# EasyEDA Pro project 无刷双驱_2025-10-18.epro, board PCB1_1
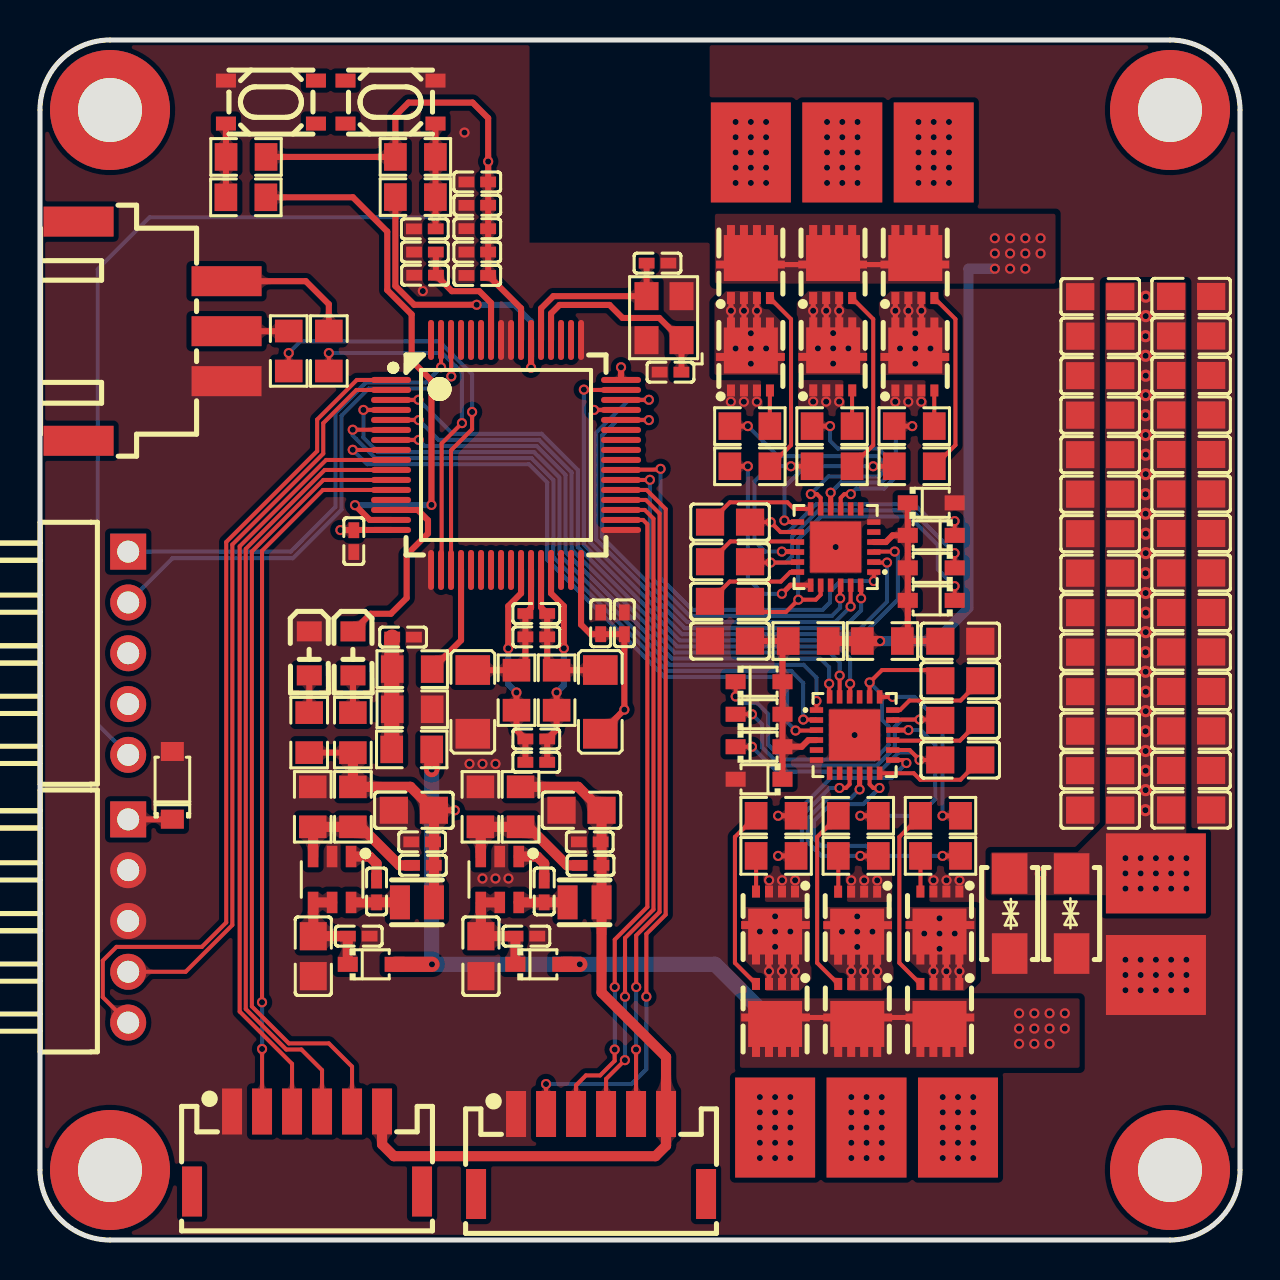
[diagram p2: board, top side]
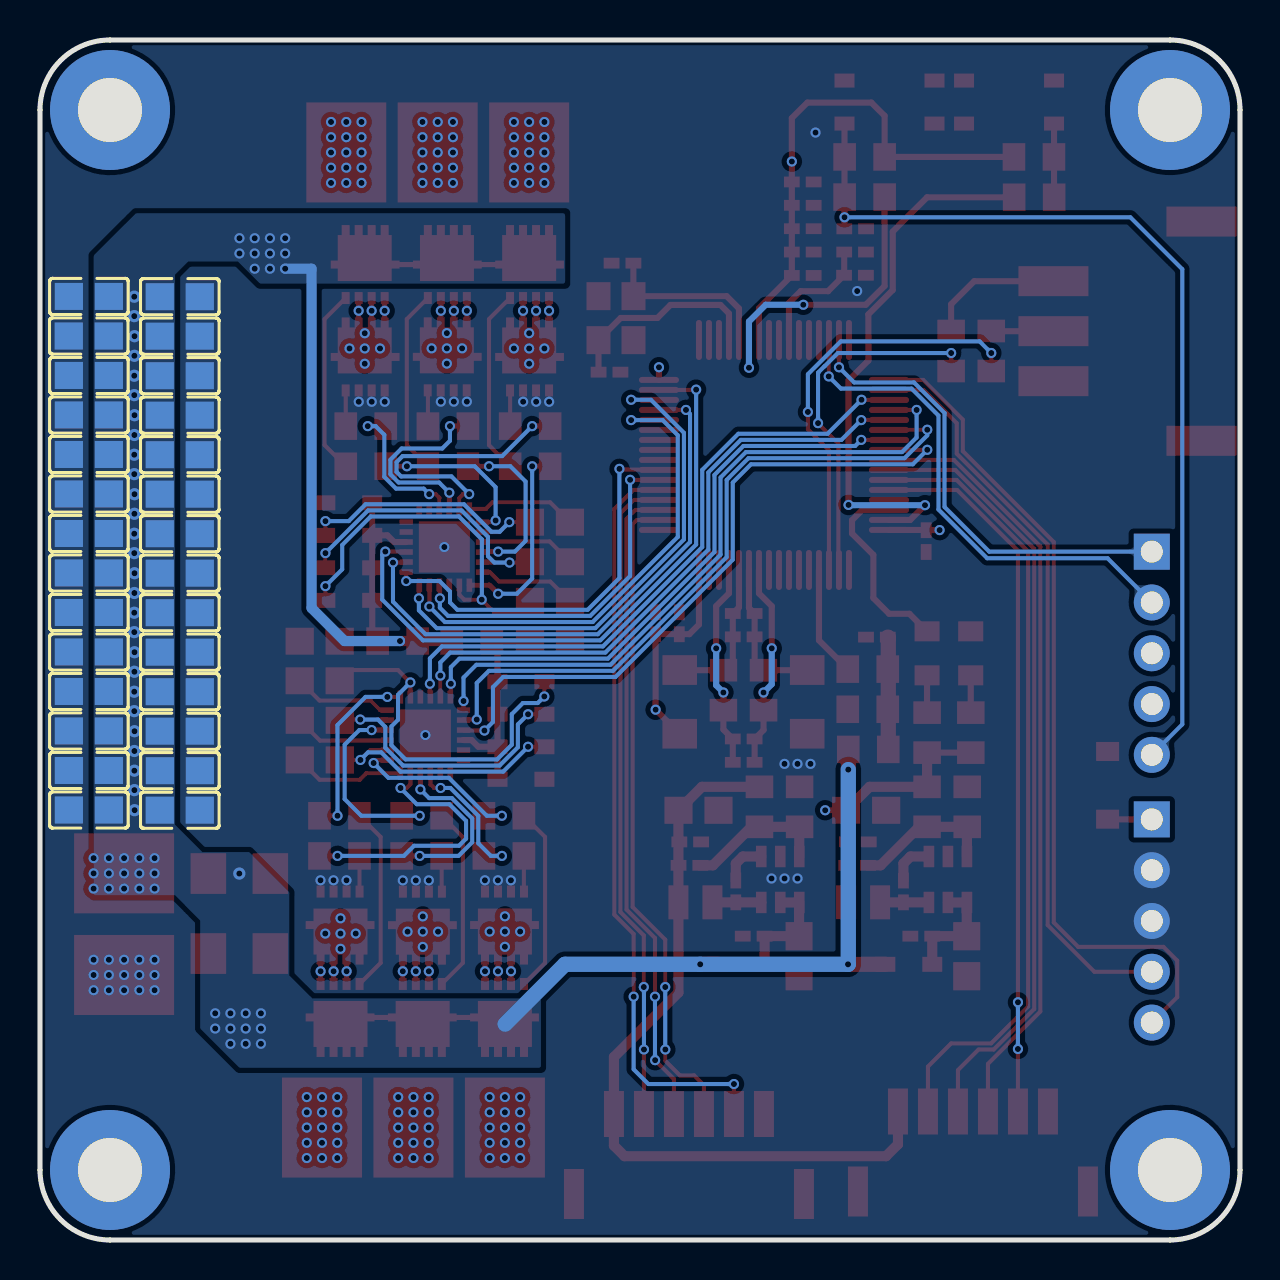
[diagram p3: board, bottom side, seen from below]

Outline 60 x 60 mm; copper layers: Top Layer, Inner1, 内层2, Bottom Layer. Coordinates in mm from the lower left corner of the outline.
Outline path: 0,56.5 0,3.5 arc(1.03,1.03) 3.5,0 56.5,0 arc(58.97,1.03) 60,3.5 60,56.5 arc(58.97,58.97) 56.5,60 3.5,60 arc(1.03,58.97) 0,56.5
Stack: Top Layer 0.035mm 外层铜厚1oz / Dielectric1 0.2104mm 7628 RC49% 8.6mil / Inner1 0.0152mm 内层铜厚 / Dielectric2 1.065mm 1.1mm H/HOZ Copper / 内层2 0.0152mm 内层铜厚 / Dielectric3 0.2104mm 7628 RC49% 8.6mil / Bottom Layer 0.035mm 外层铜厚1oz

## Design rules (mm)
template: 自定义配置
spacing copperThickness1oz (default): track to track 0.102, other pairs 0.152 to 0.3
spacing copperThickness2oz: track to track 0.203, other pairs 0.152 to 0.3
track width copperThickness1oz (default): min 0.127, default 0.254, max 2.54
track width copperThickness2oz: min 0.203, default 0.254, max 2.54
differential pair differentialPair (default): width min 0.127, default 0.254, max 2.54; gap min 0.152, default 0.152
via viaSize (default): diameter min 0.5, default 0.61, max 10; hole min 0.3, default 0.305, max 6.3
net GND uses innerPlane1

## Placement (name value [footprint] x y rotation side)
C1  4.7uF  [C0402]  19.25 48.24 180 top
C2  100nF  [C0402]  19.25 49.4 180 top
C3  4.7uF  [C0402]  24.81 30.16 0 top
C4  100nF  [C0402]  24.81 31.33 0 top
C5  2.2uF  [C0402]  24.81 25.05 0 top
C6  100nF  [C0402]  24.81 23.88 0 top
C7  100nF  [C0402]  19.24 50.56 0 top
C8  4.7uF  [C0402]  15.69 34.94 90 top
C9  4.7uF  [C0402]  29.22 30.84 270 top
C10  100nF  [C0402]  21.86 48.23 180 top
C11  100nF  [C0402]  28.03 30.83 270 top
C12  4.7uF  [C0402]  21.86 50.57 180 top
C13  100nF  [C0402]  21.86 49.4 180 top
C14  4.7uF  [C0402]  21.86 52.9 180 top
C15  10pF  [C0402]  31.53 43.39 180 top
C16  10pF  [C0402]  30.88 48.84 180 top
C17  100nF  [C0402]  21.86 51.73 180 top
C18  4.7uF  [C0805]  34.5 31.93 180 top
C19  22uF  [C0805]  57.56 45.2 0 top
C20  22uF  [C0805]  53.01 31.37 180 top
C21  100nF  [C0402]  25.21 17.43 90 top
C22  220pF  [C0402]  27.53 18.73 0 top
C23  22uF  [C0805]  27.08 21.49 0 top
C24  100nF  [C0402]  27.49 19.91 0 top
C25  4.7uF  [C0805]  46.01 27.96 0 top
C26  22uF  [C0805]  22.05 14.19 90 top
C27  100nF  [C0402]  24.32 15.19 180 top
C28  4.7uF  [C0805]  34.5 33.91 180 top
C29  4.7uF  [C0805]  46.01 25.98 0 top
C30  4.7uF  [C0805]  34.5 35.89 0 top
C31  100nF  [C0402]  16.83 17.43 90 top
C32  220pF  [C0402]  19.15 18.73 0 top
C33  22uF  [C0805]  18.69 21.49 0 top
C34  100nF  [C0402]  19.11 19.91 0 top
C35  4.7uF  [C0805]  46.01 24 180 top
C36  22uF  [C0805]  46.01 29.94 0 top
C37  22uF  [C0805]  13.66 14.19 90 top
C38  100nF  [C0402]  15.94 15.19 180 top
C39  22uF  [C0805]  34.5 29.95 180 top
C40  22uF  [C0805]  57.56 33.35 0 top
C41  22uF  [C0805]  57.56 35.33 0 top
C42  22uF  [C0805]  57.56 41.25 0 top
C43  22uF  [C0805]  57.55 23.48 0 top
C44  22uF  [C0805]  53.01 23.47 180 top
C45  22uF  [C0805]  53.01 25.44 180 top
C46  22uF  [C0805]  53.01 27.42 180 top
C47  22uF  [C0805]  57.56 27.43 0 top
C48  22uF  [C0805]  57.56 21.5 0 top
C49  100nF  [C0402]  18.15 30.14 180 top
C50  22uF  [C0805]  53.01 21.49 180 top
C51  22uF  [C0805]  57.56 43.23 0 top
C52  22uF  [C0805]  53.01 33.34 180 top
C53  22uF  [C0805]  57.56 39.28 0 top
C54  22uF  [C0805]  53.01 29.39 180 top
C55  22uF  [C0805]  57.56 47.18 0 top
C56  22uF  [C0805]  57.56 37.3 0 top
C57  22uF  [C0805]  57.56 31.38 0 top
C58  22uF  [C0805]  57.56 29.4 0 top
C59  22uF  [C0805]  57.56 25.45 0 top
C60  22uF  [C0805]  53.01 35.32 180 top
C61  22uF  [C0805]  53.01 37.29 180 top
C62  22uF  [C0805]  53.01 39.27 180 top
C63  22uF  [C0805]  53.01 41.24 180 top
C64  22uF  [C0805]  53.01 45.19 180 top
C65  22uF  [C0805]  53.01 47.17 180 top
C66  22uF  [C0805]  53.01 43.22 180 top
C67  22uF  [C0805]  57.56 23.48 180 bottom
C68  22uF  [C0805]  53.01 29.39 0 bottom
C69  22uF  [C0805]  57.56 25.45 180 bottom
C70  22uF  [C0805]  57.56 33.35 180 bottom
C71  22uF  [C0805]  57.56 29.4 180 bottom
C72  22uF  [C0805]  57.56 27.43 180 bottom
C73  22uF  [C0805]  53.01 39.27 0 bottom
C74  22uF  [C0805]  53.01 37.29 0 bottom
C75  22uF  [C0805]  57.56 31.38 180 bottom
C76  22uF  [C0805]  53.01 31.37 0 bottom
C77  22uF  [C0805]  57.56 43.23 180 bottom
C78  22uF  [C0805]  53.01 33.34 0 bottom
C79  22uF  [C0805]  53.01 35.32 0 bottom
C80  22uF  [C0805]  57.56 41.25 180 bottom
C81  22uF  [C0805]  57.56 45.2 180 bottom
C82  22uF  [C0805]  57.56 47.18 180 bottom
C83  22uF  [C0805]  57.56 35.33 180 bottom
C84  22uF  [C0805]  57.56 21.5 180 bottom
C85  22uF  [C0805]  57.56 37.3 180 bottom
C86  22uF  [C0805]  53.01 41.24 0 bottom
C87  22uF  [C0805]  57.56 39.28 180 bottom
C88  22uF  [C0805]  53.01 25.44 0 bottom
C89  22uF  [C0805]  53.01 27.42 0 bottom
C90  22uF  [C0805]  53.01 43.22 0 bottom
C91  22uF  [C0805]  53 23.47 0 bottom
C92  22uF  [C0805]  53.01 21.49 0 bottom
C93  22uF  [C0805]  53.01 45.19 0 bottom
C94  22uF  [C0805]  53.01 47.17 0 bottom
D1  B5819WS  [SOD-323_L1.8-W1.3-LS2.5-RD]  24.94 13.78 0 top
D3  SMAJ16CA  [SMA_L4.4-W2.6-LS5.0-BI]  51.58 16.32 270 top
D4  B5819WS  [SOD-323_L1.8-W1.3-LS2.5-RD]  44.56 31.98 180 top
D5  B5819WS  [SOD-323_L1.8-W1.3-LS2.5-RD]  35.95 27.91 0 top
D6  B5819WS  [SOD-323_L1.8-W1.3-LS2.5-RD]  44.56 33.61 180 top
D7  B5819WS  [SOD-323_L1.8-W1.3-LS2.5-RD]  35.95 26.29 0 top
D8  B5819WS  [SOD-323_L1.8-W1.3-LS2.5-RD]  44.56 35.23 180 top
D9  B5819WS  [SOD-323_L1.8-W1.3-LS2.5-RD]  35.95 24.66 0 top
D10  B5819WS  [SOD-323_L1.8-W1.3-LS2.5-RD]  44.56 36.86 0 top
D11  B5819WS  [SOD-323_L1.8-W1.3-LS2.5-RD]  35.95 23.04 180 top
D12  SMF3.3A  [SOD-123_L2.8-W1.8-LS3.7-RD]  6.62 22.73 90 top
D13  B5819WS  [SOD-323_L1.8-W1.3-LS2.5-RD]  16.56 13.78 0 top
D14  SMAJ16CA  [SMA_L4.4-W2.6-LS5.0-BI]  48.48 16.32 90 top
FB1  120R  [L1206]  28.01 26.91 90 top
FB2  120R  [L1206]  21.64 26.91 90 top
H2  PZ254R-11-05P  [HDR-TH_5P-P2.54-H-M-W10.4]  4.41 29.34 270 top
H3  PZ254R-11-05P  [HDR-TH_5P-P2.54-H-M-W10.4]  4.41 15.95 270 top
L1  4.7uH  [IND-SMD_L2.0-W1.6-B]  27.23 16.88 0 top
L2  4.7uH  [IND-SMD_L2.0-W1.6-B]  18.85 16.88 0 top
LED1  -  [LED_0805]  13.46 29.28 270 top
LED2  -  [LED_0805]  15.64 29.28 270 top
NC1  RH-5000  [TEST-TH_BD2.54-P1.4_RED]  55.8 18.33 0 top
NC2  RH-5000  [TEST-TH_BD2.54-P1.4_RED]  55.8 13.25 0 top
NC3  RH-5000  [TEST-TH_BD2.54-P1.4_RED]  35.54 54.38 90 top
NC4  RH-5000  [TEST-TH_BD2.54-P1.4_RED]  40.11 54.38 90 top
NC5  RH-5000  [TEST-TH_BD2.54-P1.4_RED]  44.69 54.38 90 top
NC6  RH-5000  [TEST-TH_BD2.54-P1.4_RED]  45.9 5.62 90 top
NC7  RH-5000  [TEST-TH_BD2.54-P1.4_RED]  41.33 5.62 270 top
NC8  RH-5000  [TEST-TH_BD2.54-P1.4_RED]  36.76 5.62 270 top
NOREF  -  [Pad_e262]  56.5 56.5 0 top
NOREF#2  -  [Pad_e260]  3.5 3.5 0 top
NOREF#3  -  [Pad_e258]  3.5 56.5 0 top
NOREF#4  -  [Pad_e261]  56.5 3.5 0 top
P1  BX-XH2.54-3PWT  [CONN-SMD_3P-P2.50_BX-XH2.54-3PWT]  5.63 45.44 270 top
P3  ZX-ZH1.5-6PWT  [CONN-SMD_6P-P1.50_ZX-ZH1.5-6PWT]  13.35 4.43 0 top
P4  ZX-ZH1.5-6PWT  [CONN-SMD_6P-P1.50_ZX-ZH1.5-6PWT]  27.55 4.3 0 top
Q1  TPN2R703NL,L1Q(M  [TSON-8_L3.1-W3.1-P0.65-LS3.3-BL-EP]  35.52 48.77 0 top
Q2  TPN2R703NL,L1Q(M  [TSON-8_L3.1-W3.1-P0.65-LS3.3-BL-EP]  39.63 48.77 0 top
Q3  TPN2R703NL,L1Q(M  [TSON-8_L3.1-W3.1-P0.65-LS3.3-BL-EP]  43.74 48.77 0 top
Q4  TPN2R703NL,L1Q(M  [TSON-8_L3.1-W3.1-P0.65-LS3.3-BL-EP]  45 11.13 180 top
Q5  TPN2R703NL,L1Q(M  [TSON-8_L3.1-W3.1-P0.65-LS3.3-BL-EP]  40.88 11.13 180 top
Q6  TPN2R703NL,L1Q(M  [TSON-8_L3.1-W3.1-P0.65-LS3.3-BL-EP]  36.78 11.13 180 top
Q7  TPN2R703NL,L1Q(M  [TSON-8_L3.1-W3.1-P0.65-LS3.3-BL-EP]  35.52 44.15 0 top
Q8  TPN2R703NL,L1Q(M  [TSON-8_L3.1-W3.1-P0.65-LS3.3-BL-EP]  39.64 44.16 0 top
Q9  TPN2R703NL,L1Q(M  [TSON-8_L3.1-W3.1-P0.65-LS3.3-BL-EP]  43.74 44.15 0 top
Q10  TPN2R703NL,L1Q(M  [TSON-8_L3.1-W3.1-P0.65-LS3.3-BL-EP]  45 15.75 180 top
Q11  TPN2R703NL,L1Q(M  [TSON-8_L3.1-W3.1-P0.65-LS3.3-BL-EP]  40.88 15.74 180 top
Q12  TPN2R703NL,L1Q(M  [TSON-8_L3.1-W3.1-P0.65-LS3.3-BL-EP]  36.78 15.75 180 top
R1  10K  [R0805]  18.77 54.15 0 top
R2  0Ω  [R0805]  25.83 27.49 270 top
R3  100R  [R0805]  42.12 29.95 0 top
R4  100R  [R0805]  18.77 52.15 0 top
R5  100R  [R0805]  38.41 29.95 180 top
R6  4.7R  [R0805]  35.49 38.69 0 top
R7  4.7R  [R0805]  39.6 38.69 0 top
R8  0Ω  [R0805]  23.82 27.49 270 top
R9  100R  [R0805]  10.29 52.14 180 top
R10  4.7K  [R0805]  10.3 54.15 180 top
R11  4.7R  [R0805]  43.71 38.69 0 top
R12  1K  [R0805]  13.46 25.37 90 top
R13  4.7R  [R0805]  45.03 21.21 180 top
R14  4.7R  [R0805]  40.91 21.21 180 top
R15  4.7R  [R0805]  36.81 21.21 180 top
R16  4.7R  [R0805]  35.49 40.69 0 top
R17  1K  [R0805]  15.64 25.37 90 top
R18  4.7R  [R0805]  39.6 40.69 0 top
R19  4.7R  [R0805]  43.71 40.69 0 top
R20  100R  [R0805]  14.44 44.45 270 top
R21  4.7R  [R0805]  45.03 19.2 180 top
R22  73.2K  [R0805]  24.03 21.66 90 top
R23  10K  [R0805]  22.02 21.66 270 top
R24  4.7R  [R0805]  40.91 19.2 180 top
R25  4.7R  [R0805]  36.81 19.2 180 top
R26  100R  [R0805]  12.44 44.45 270 top
R38  45.3K  [R0805]  15.65 21.66 90 top
R45  10K  [R0805]  13.64 21.66 270 top
R68  1K  [R0805]  18.61 26.54 180 top
R69  10K  [R0805]  18.59 24.53 0 top
R70  100R  [R0805]  18.61 28.54 0 top
S1  TS1145A26025  [SW-SMD_4P-L4.2-W3.2-P2.15-LS4.6]  17.53 56.9 180 top
S2  TS1145A26025  [SW-SMD_4P-L4.2-W3.2-P2.15-LS4.6]  11.55 56.9 0 top
U1  CYT2BL3CAAQ0AZEGS  [LQFP-64_L10.0-W10.0-P0.50-LS12.0-BL]  23.3 39.25 270 top
U2  FD6288Q  [QFN-24_L4.0-W4.0-P0.50-BL-EP2.6]  39.78 34.65 90 top
U4  RY9121E  [SOT-23-6_L2.9-W1.6-P0.95-LS2.8-BL]  22.99 18.03 180 top
U5  FD6288Q  [QFN-24_L4.0-W4.0-P0.50-BL-EP2.6]  40.73 25.25 270 top
U7  RY9121E  [SOT-23-6_L2.9-W1.6-P0.95-LS2.8-BL]  14.6 18.03 180 top
Y1  16MHz  [OSC-SMD_4P-L3.2-W2.5-BL]  31.2 46.09 90 top

## Footprints (pads in the part's own frame, mm; a bottom-side part is the same pattern mirrored in y, then rotated)
C0402
  rect 0.79x0.54 smd: 1(-0.545,0) 2(0.545,0)
C0805
  rect 1.41x1.35 smd: 1(-1,0) 2(1,0)
CONN-SMD_3P-P2.50_BX-XH2.54-3PWT
  rect 1.5x3.5 smd: 1(-2.5,3.7) 2(0,3.7) 3(2.5,3.7) 4(5.48,-3.7) 5(-5.48,-3.7)
CONN-SMD_6P-P1.50_ZX-ZH1.5-6PWT
  rect 1x2.3 smd: 1(-3.75,2) 2(-2.25,2) 3(-0.75,2) 4(0.75,2) 5(2.25,2) 6(3.75,2)
  rect 1x2.5 smd: 7(5.75,-2) 8(-5.75,-2)
HDR-TH_5P-P2.54-H-M-W10.4
  rect 1.8x1.8 hole 1.1: 1(-5.08,0)
  round 1.8 hole 1.1: 2(-2.54,0) 3(0,0) 4(2.54,0) 5(5.08,0)
IND-SMD_L2.0-W1.6-B
  rect 1x1.7 smd: 1(-0.85,0) 2(0.85,0)
L1206
  rect 1.485x1.728 smd: 1(-1.593,0) 2(1.593,0)
LED_0805
  rect 1x1.25 smd: 1(-1.15,0.005) 2(1.05,0.005)
LQFP-64_L10.0-W10.0-P0.50-LS12.0-BL
  oval 0.3x2 smd: 1(-3.75,-5.75) 2(-3.25,-5.75) 3(-2.75,-5.75) 4(-2.25,-5.75) 5(-1.75,-5.75) 6(-1.25,-5.75) 7(-0.75,-5.75) 8(-0.25,-5.75) 9(0.25,-5.75) 10(0.75,-5.75) 11(1.25,-5.75) 12(1.75,-5.75) 13(2.25,-5.75) 14(2.75,-5.75) 15(3.25,-5.75) 16(3.75,-5.75) 33(3.75,5.75) 34(3.25,5.75) 35(2.75,5.75) 36(2.25,5.75) 37(1.75,5.75) 38(1.25,5.75) 39(0.75,5.75) 40(0.25,5.75) 41(-0.25,5.75) 42(-0.75,5.75) 43(-1.25,5.75) 44(-1.75,5.75) 45(-2.25,5.75) 46(-2.75,5.75) 47(-3.25,5.75) 48(-3.75,5.75)
  oval 2x0.3 smd: 17(5.75,-3.75) 18(5.75,-3.25) 19(5.75,-2.75) 20(5.75,-2.25) 21(5.75,-1.75) 22(5.75,-1.25) 23(5.75,-0.75) 24(5.75,-0.25) 25(5.75,0.25) 26(5.75,0.75) 27(5.75,1.25) 28(5.75,1.75) 29(5.75,2.25) 30(5.75,2.75) 31(5.75,3.25) 32(5.75,3.75) 49(-5.75,3.75) 50(-5.75,3.25) 51(-5.75,2.75) 52(-5.75,2.25) 53(-5.75,1.75) 54(-5.75,1.25) 55(-5.75,0.75) 56(-5.75,0.25) 57(-5.75,-0.25) 58(-5.75,-0.75) 59(-5.75,-1.25) 60(-5.75,-1.75) 61(-5.75,-2.25) 62(-5.75,-2.75) 63(-5.75,-3.25) 64(-5.75,-3.75)
OSC-SMD_4P-L3.2-W2.5-BL
  rect 1.4x1.2 smd: 1(-1.1,-0.875) 2(1.1,-0.875) 3(1.1,0.875) 4(-1.1,0.875)
Pad_e258
  round 6 hole 3.2: 1(0,0)
Pad_e260
  round 6 hole 3.2: 1(0,0)
Pad_e261
  round 6 hole 3.2: 1(0,0)
Pad_e262
  round 6 hole 3.2: 1(0,0)
QFN-24_L4.0-W4.0-P0.50-BL-EP2.6
  rect 0.28x0.665 smd: 1(-1.25,-1.907) 2(-0.75,-1.907) 3(-0.25,-1.907) 4(0.25,-1.907) 5(0.75,-1.907) 6(1.25,-1.907) 13(1.25,1.907) 14(0.75,1.907) 15(0.25,1.907) 16(-0.25,1.907) 17(-0.75,1.907) 18(-1.25,1.907)
  rect 0.665x0.28 smd: 7(1.907,-1.25) 8(1.907,-0.75) 9(1.907,-0.25) 10(1.907,0.25) 11(1.907,0.75) 12(1.907,1.25) 19(-1.907,1.25) 20(-1.907,0.75) 21(-1.907,0.25) 22(-1.907,-0.25) 23(-1.907,-0.75) 24(-1.907,-1.25)
  rect 2.55x2.55 smd: 25(0,0)
R0805
  rect 1.133x1.377 smd: 1(-1,0) 2(1,0)
SMA_L4.4-W2.6-LS5.0-BI
  rect 2.032x1.778 smd: 1(-2,0) 2(2,0)
SOD-123_L2.8-W1.8-LS3.7-RD
  rect 0.95x1.15 smd: 1(-1.692,0) 2(1.692,0)
SOD-323_L1.8-W1.3-LS2.5-RD
  rect 1x0.75 smd: 1(-1.173,0) 2(1.173,0)
SOT-23-6_L2.9-W1.6-P0.95-LS2.8-BL
  rect 0.532x1.072 smd: 1(-0.95,-1.149) 2(0,-1.149) 3(0.95,-1.149) 4(0.95,1.149) 5(0,1.149) 6(-0.95,1.149)
SW-SMD_4P-L4.2-W3.2-P2.15-LS4.6
  rect 1x0.7 smd: 1(-2.25,1.075) 2(2.25,1.075) 3(-2.25,-1.075) 4(2.25,-1.075)
TEST-TH_BD2.54-P1.4_RED
  rect 5x4 smd: 1(0,0)
TSON-8_L3.1-W3.1-P0.65-LS3.3-BL-EP
  rect 0.4x0.6 smd: 1(-0.975,-1.675) 2(-0.325,-1.675) 3(0.325,-1.675) 4(0.975,-1.675) 5(0.975,1.675) 6(0.325,1.675) 7(-0.325,1.675) 8(-0.975,1.675)
  rect 0.6x0.4 smd: 9(-1.42,0) 9(1.42,0)
  rect 2.7x2.3 smd: 9(0.02,0.325)

## Nets
As in the schematic.

Pads without a net: H2 3 4; NOREF 1; NOREF#2 1; NOREF#3 1; NOREF#4 1; P1 4 5; P3 7 8; P4 7 8; S1 2 4; S2 2 4; U1 13 21 22 23 24 25 30 31 40 41 42 43 50 51 59 60 61 64; U2 5 7 8 21; U5 5 7 8 21

## Via types
v1: diameter 0.508, hole 0.305, Top Layer to Bottom Layer, 312 vias
v2: diameter 0.61, hole 0.305, Top Layer to Bottom Layer, 28 vias

## Routing (per net, layer and track width the routed paths; a pad name or vN(x,y) marks a point on that pad's centre or on a via; arc(x,y) is an arc through that point)
GND:
  vias: v1(19.14,47.45) v1(21.22,55.37) v1(21.48,23.81) v1(22.13,23.81) v1(22.12,18.08) v1(22.78,23.81) v1(22.77,18.08) v1(23.42,18.08) v1(34.54,41.91) v1(35.19,41.91) v1(35.84,41.91) v1(36.46,17.99) v1(37.1,17.99) v1(37.75,17.99) v1(38.66,41.92) v1(39.31,41.92) v1(39.78,34.65) v1(39.96,41.92) v1(40.56,17.98) v1(40.73,25.25) v1(41.21,17.98) v1(41.86,17.98) v1(42.76,41.91) v1(43.41,41.91) v1(44.06,41.91) v1(44.68,17.99) v1(45.32,17.99) v1(45.97,17.99) v1(54.27,14.01) v1(54.27,13.25) v1(54.27,12.49) v1(55.03,14.01) v1(55.03,13.25) v1(55.03,12.49) v1(55.8,14.01) v1(55.8,13.25) v1(55.8,12.49) v1(56.56,14.01) v1(56.56,13.25) v1(56.56,12.49) v1(57.32,14.01) v1(57.32,13.25) v1(57.32,12.49)
VBAT: length 62.9
  Top Layer w0.254: Q1.9 Q2.9 ; Q6.9 Q5.9 ; Q5.9 Q4.9 ; Q3.9 Q2.9
  Top Layer w0.508: v1(42,29.95) R3.1 R5.1
  Top Layer w0.762: D1.2 v1(26.99,13.78) ; R69.2 v1(19.59,23.52) ; D13.2 v1(19.6,13.78)
  Bottom Layer w0.508: v1(47.74,48.56) 46.42,48.57 46.42,31.6 44.77,29.95 v1(42,29.95)
  Bottom Layer w0.762: v1(19.59,23.52) 19.59,13.8 v1(19.6,13.78) v1(26.99,13.78) 33.75,13.78 36.74,10.8
  vias: v1(47.74,50.09) v1(47.74,49.33) v1(48.5,50.09) v1(48.5,49.33) v1(48.5,48.56) v1(48.95,11.33) v1(48.95,10.57) v1(48.95,9.81) v1(49.27,50.09) v1(49.27,49.33) v1(49.27,48.56) v1(49.72,11.33) v1(49.72,10.57) v1(49.72,9.81) v1(50.03,50.09) v1(50.03,49.33) v1(50.48,11.33) v1(50.48,10.57) v1(50.48,9.81) v1(51.24,11.33) v1(51.24,10.57) v1(54.27,19.09) v1(54.27,18.33) v1(54.27,17.57) v1(55.03,19.09) v1(55.03,18.33) v1(55.03,17.57) v1(55.8,19.09) v1(55.8,18.33) v1(55.8,17.57) v1(56.56,19.09) v1(56.56,18.33) v1(56.56,17.57) v1(57.32,19.09) v1(57.32,18.33) v1(57.32,17.57) v2(50.04,18.32) v2(55.29,47.17) v2(55.29,46.19) v2(55.28,45.19) v2(55.28,44.21) v2(55.29,43.22) v2(55.29,42.24) v2(55.28,41.24) v2(55.28,40.25) v2(55.29,39.27) v2(55.29,38.29) v2(55.28,37.29) v2(55.28,36.31) v2(55.29,35.31) v2(55.29,34.34) v2(55.28,33.34) v2(55.28,32.35) v2(55.29,31.36) v2(55.29,30.39) v2(55.28,29.39) v2(55.28,28.41) v2(55.29,27.41) v2(55.29,26.44) v2(55.28,25.44) v2(55.28,24.45) v2(55.28,23.47) v2(55.28,22.49) v2(55.27,21.49)
VCC1V1: length 6.3
  Top Layer w0.305: U1.58 22.55,46.85 21.96,47.44 20.59,47.44 C1.1 19.79,48.24 C2.1
VCC3.3V: length 126.9
  Top Layer w0.305: U1.48 v1(29.05,43.64) ; R10.1 R1.1 17.77,56.21 18.43,56.87 21.63,56.87 22.41,56.09 v1(22.41,53.92) C14.1 C17.1 C12.1 C13.1 C10.1 24.05,46.58 U1.55 ; 4.41,21.03 6.61,21.03 D12.1 ; FB1.1 v1(29.22,26.52) C9.2 27.53,30.29 27.05,30.77 U1.32 ; U1.16 15.7,35.5 C8.2 15.68,35.5 v1(15.02,35.5) ; R17.1 R12.1 ; C33.2 v1(20.74,21.49)
  Top Layer w0.508: R17.1 15.65,24.37 R38.2 18.52,22.66 C33.2 19.7,21.48 L2.2
  Inner1 w0.305: 15.02,21.49 4.86,21.49 4.41,21.03 ; 15.02,21.49 v1(15.02,35.5) ; 15.02,21.49 v1(20.74,21.49) 24.19,21.49 v1(29.22,26.52) 29.22,43.47 v1(29.05,43.64) 22.41,50.28 v1(22.41,53.92)
VCC5V: length 38.9
  Top Layer w0.508: R22.2 26.9,22.66 C23.2 28.08,21.48 L1.2 28.08,12.37 31.3,9.15 P4.6 31.3,4.72 30.77,4.19 17.69,4.19 17.1,4.78 P3.6
VDDA: length 7.5
  Top Layer w0.305: FB1.2 28.01,28.49 R2.1 25.36,28.96 C3.2 C4.2 25.05,31.63 U1.28
VSSA: length 7.5
  Top Layer w0.305: FB2.2 21.65,28.49 R8.1 24.27,28.94 C3.1 C4.1 24.55,31.61 U1.27
BATADC: length 5.6
  Top Layer w0.305: U1.20 21.05,29.98 R70.2
DBG_RX: length 42.1
  Top Layer w0.203: 4.41,10.87 3.14,12.14 3.14,13.97 3.83,14.66 8.09,14.66 9.31,15.87 9.31,34.9 13.86,39.45 13.86,41.02 15.84,43 U1.1
DBG_TX: length 37.2
  Top Layer w0.203: 4.41,13.41 7.28,13.41 9.62,15.75 9.62,34.77 14.16,39.32 14.16,40.84 15.82,42.5 U1.2
ECD1_CS: length 35.7
  Top Layer w0.203: P3.2 11.1,6.82 11.1,6.82 v1(11.1,9.55) ; U1.12 14.15,37.5 11.1,34.46 v1(11.1,11.89)
  Bottom Layer w0.203: v1(11.1,9.55) 11.1,11.89 v1(11.1,11.89)
ECD1_MISO: length 38.7
  Top Layer w0.203: U1.9 14.3,39 9.98,34.68 9.98,11.42 12.6,8.81 P3.3
ECD1_MOSI: length 39.1
  Top Layer w0.203: P3.4 14.1,8.49 13.07,9.52 12.31,9.52 10.29,11.55 10.29,34.56 14.24,38.5 U1.10
ECD1_SCLK: length 39.7
  Top Layer w0.203: U1.11 14.17,38 10.59,34.43 10.59,11.68 12.44,9.83 14.44,9.83 15.6,8.67 P3.5
ECD2_CS: length 37.9
  Top Layer w0.203: v1(30.32,12.17) 30.32,15.3 31.28,16.27 31.28,36.55 30.33,37.5 U1.37 ; P4.2 v1(25.3,7.8)
  Bottom Layer w0.203: v1(30.32,12.17) 30.32,8.53 29.58,7.8 v1(25.3,7.8)
ECD2_MISO: length 32.8
  Top Layer w0.203: v1(28.74,12.65) 28.74,15.02 30.37,16.65 30.37,35.79 30.16,36 U1.34 ; P4.3 26.8,7.74 27.29,8.23 28.01,8.23 28.73,8.96 v1(28.73,9.53)
  Bottom Layer w0.203: v1(28.73,9.53) 28.74,9.53 v1(28.74,12.65)
ECD2_MOSI: length 32.5
  Top Layer w0.203: v1(29.25,12.17) 29.25,15.1 30.67,16.52 30.67,36.07 30.24,36.5 U1.35 ; P4.4 28.3,8.05 ; 28.3,8.05 v1(29.24,8.99)
  Bottom Layer w0.203: v1(29.24,8.99) 29.25,9 v1(29.25,12.17)
ECD2_SCLK: length 32.7
  Top Layer w0.203: v1(29.81,12.65) 29.81,15.23 30.98,16.4 30.98,36.32 30.3,37 U1.36 ; P4.5 v1(29.8,9.53)
  Bottom Layer w0.203: v1(29.8,9.53) 29.8,12.64 v1(29.81,12.65)
ECO_IN: length 10.4
  Top Layer w0.305: C15.1 32.08,43.4 Y1.1 30.97,46.1 29.13,46.1 28.48,46.75 25.98,46.75 25.55,46.33 U1.52
ECO_OUT: length 8.8
  Top Layer w0.305: C16.2 30.33,47.2 Y1.3 25.67,47.19 25.05,46.58 U1.53
HOA1: length 10.1
  Top Layer w0.254: R6.1 v1(35.39,38.69) ; U2.19 37.52,32.74 v1(37.09,32.31)
  Bottom Layer w0.203: v1(37.09,32.31) 36.15,32.31 35.39,33.07 v1(35.39,38.69)
HOA2: length 9.2
  Top Layer w0.203: U5.19 v1(42.63,27.16)
  Top Layer w0.254: R13.1 v1(45.13,21.21)
  Bottom Layer w0.203: v1(45.13,21.21) 45.13,25.75 43.72,27.16 v1(42.63,27.16)
HOB1: length 8.6
  Top Layer w0.254: U2.16 37.85,34.42 v1(37.09,34.42) ; 38.6,38.69 v1(37.55,38.69)
  Bottom Layer w0.203: v1(37.55,38.69) 36.48,38.69 35.72,37.92 35.72,34.95 36.25,34.42 v1(37.09,34.42)
HOB2: length 10.1
  Top Layer w0.254: 42.64,25.5 v1(43.42,25.5) ; R14.1 v1(41.02,21.21)
  Bottom Layer w0.203: v1(41.02,21.21) 43.93,21.21 44.77,22.05 44.77,24.76 44.03,25.5 v1(43.42,25.5)
HOC1: length 8.3
  Top Layer w0.203: U2.13 37.3,35.9 v1(37.22,35.97)
  Top Layer w0.254: R11.1 v1(41.66,38.69)
  Bottom Layer w0.203: v1(41.66,38.69) 38.26,38.69 37.22,37.64 v1(37.22,35.97)
HOC2: length 9.1
  Top Layer w0.203: v1(43.32,23.85) 43.17,24 U5.13
  Top Layer w0.254: R15.1 v1(36.91,21.21)
  Bottom Layer w0.203: v1(36.91,21.21) 37.66,21.21 39.56,23.11 42.58,23.11 v1(43.32,23.85)
KEYMOD: length 27.3
  Top Layer w0.305: v1(19.57,36.75) 19.57,42.98 18.58,43.97 18.58,46.28 17.36,47.5 17.36,50.42 15.65,52.14 R9.1 ; U1.15 16.49,36 v1(15.75,36.74)
  Bottom Layer w0.305: v1(15.75,36.74) 19.56,36.74 v1(19.57,36.75)
LEDMOD: length 9.8
  Top Layer w0.305: U1.14 18.89,36.5 19.4,35.99 19.4,35.33 18.33,34.26 18.33,32.1 17.54,31.31 16.53,31.31 LED2.1
LOA1: length 14.1
  Top Layer w0.203: U2.11 39.03,37.11 38.85,37.29 v1(38.54,37.29)
  Top Layer w0.254: R16.1 v1(35.39,40.69)
  Bottom Layer w0.203: v1(35.39,40.69) 36.89,39.19 41.87,39.19 42.17,38.89 42.17,38.41 41.94,38.18 39.43,38.18 v1(38.54,37.29)
LOA2: length 13.7
  Top Layer w0.203: U5.11 41.48,22.78 41.66,22.6 v1(41.97,22.6)
  Top Layer w0.254: R21.1 v1(45.13,19.2)
  Bottom Layer w0.203: v1(45.13,19.2) 41.8,19.2 41.3,19.71 39.05,19.71 38.7,20.06 38.7,20.95 39.53,21.79 41.16,21.79 v1(41.97,22.6)
LOB1: length 9.9
  Top Layer w0.254: U2.10 v1(39.53,37.36) ; R18.1 v1(39.5,40.69)
  Bottom Layer w0.203: v1(39.5,40.69) 39.5,39.96 39.89,39.58 41.92,39.58 42.48,39.02 42.48,38.28 42.07,37.87 40.04,37.87 v1(39.53,37.36)
LOB2: length 9
  Top Layer w0.254: R24.1 v1(41.02,19.2) ; U5.10 v1(40.98,22.53)
  Bottom Layer w0.203: v1(40.98,22.53) 40.54,22.09 39.4,22.09 38.39,21.08 38.39,19.89 39.07,19.2 v1(41.02,19.2)
LOC1: length 7.8
  Top Layer w0.203: U2.9 40.03,37.11 40.22,37.29 v1(40.54,37.29)
  Top Layer w0.254: R19.1 v1(43.61,40.69)
  Bottom Layer w0.203: v1(43.61,40.69) 43.21,40.69 42.78,40.26 42.78,38.16 42.2,37.57 40.82,37.57 v1(40.54,37.29)
LOC2: length 7.3
  Top Layer w0.203: v1(39.97,22.6) 40.3,22.6 40.48,22.78 U5.9
  Top Layer w0.254: R25.1 v1(36.91,19.2)
  Bottom Layer w0.203: v1(39.97,22.6) 39.48,22.6 38.09,21.21 38.09,19.84 37.46,19.2 v1(36.91,19.2)
PWM1AH: length 17.9
  Top Layer w0.203: v1(40.01,32.08) 40.01,32.72 U2.22 ; v1(30.5,38.01) 30.49,38 U1.38
  Bottom Layer w0.203: v1(40.01,32.08) 40.01,31.61 39.6,31.2 32.49,31.2 30.5,33.2 v1(30.5,38.01)
PWM1AL: length 20.1
  Top Layer w0.203: v1(31.03,38.56) 30.99,38.52 29.07,38.52 U1.39 ; U2.1 v1(41.69,32.95)
  Bottom Layer w0.203: v1(41.69,32.95) 40.02,32.95 39.5,32.42 39.5,31.88 39.13,31.51 32.62,31.51 31.03,33.1 v1(31.03,38.56)
PWM1BH: length 24.7
  Top Layer w0.203: U1.44 30.44,41 v1(30.44,41) ; v1(40.53,31.67) 40.53,32.74 U2.23
  Bottom Layer w0.203: v1(40.53,31.67) 39.75,30.9 32.36,30.9 28.11,35.15 28.11,40.23 28.87,41 v1(30.44,41)
PWM1BL: length 28.1
  Top Layer w0.203: v1(42.35,33.87) 41.72,33.87 U2.2 ; 29.05,41.5 v1(27.7,41.5)
  Bottom Layer w0.203: v1(27.7,41.5) 27.5,41.3 27.5,34.9 32.11,30.29 40.73,30.29 42.35,31.91 v1(42.35,33.87)
PWM1CH: length 26.8
  Top Layer w0.203: U2.24 41.06,32.72 v1(41.06,32.08) ; v1(30.44,42.01) 30.44,42 U1.46
  Bottom Layer w0.203: v1(30.44,42.01) 29.45,42.01 27.8,40.36 27.8,35.03 32.24,30.59 40.17,30.59 41.06,31.48 v1(41.06,32.08)
PWM1CL: length 31.7
  Top Layer w0.203: v1(27.19,42.52) 27.21,42.5 U1.47 ; U2.3 41.72,34.42 v1(42.73,34.42)
  Bottom Layer w0.203: v1(27.19,42.52) 27.19,34.77 31.98,29.98 40.85,29.98 42.89,32.02 42.89,34.27 v1(42.73,34.42)
PWM2AH: length 32.5
  Top Layer w0.203: U5.22 40.51,27.18 v1(40.51,27.81) ; v1(18.93,42.01) 18.92,42 U1.3
  Bottom Layer w0.203: v1(18.93,42.01) 20.63,40.31 25.08,40.31 26.89,38.51 26.89,34.65 31.86,29.68 39.91,29.68 40.51,29.08 v1(40.51,27.81)
PWM2AL: length 34.3
  Top Layer w0.203: 38.82,26.5 v1(38.82,26.95) ; U1.4 16.17,41.5
  Bottom Layer w0.203: v1(16.17,41.5) 16.17,40.13 16.9,39.4 24.7,39.4 25.97,38.13 25.97,34.27 31.48,28.76 38.18,28.76 38.82,28.12 v1(38.82,26.95)
PWM2BH: length 31.4
  Top Layer w0.203: v1(18.94,41) 18.93,41 U1.5 ; U5.23 39.98,27.16 v1(39.98,28.22)
  Bottom Layer w0.203: v1(18.94,41) 19.93,40.01 24.96,40.01 26.58,38.38 26.58,34.52 31.73,29.37 39.49,29.37 39.98,28.88 v1(39.98,28.22)
PWM2BL: length 34.6
  Top Layer w0.203: v1(38.16,26.02) 38.8,26.02 U5.2 ; v1(15.64,40.51) 17.54,40.51 U1.6
  Bottom Layer w0.203: v1(38.16,26.02) 38.16,27.85 37.56,28.46 31.35,28.46 25.67,34.14 25.67,38 24.58,39.09 16.77,39.09 15.64,40.23 v1(15.64,40.51)
PWM2CH: length 30.4
  Top Layer w0.203: v1(18.94,40) 18.94,40 U1.7 ; v1(39.46,27.81) 39.46,27.18 U5.24
  Bottom Layer w0.203: v1(39.46,27.81) 39.46,28.64 39.03,29.07 31.6,29.07 26.28,34.39 26.28,38.25 24.83,39.7 19.24,39.7 v1(18.94,40)
PWM2CL: length 34.2
  Top Layer w0.203: v1(37.78,25.47) 38.8,25.47 38.82,25.5 ; v1(15.64,39.51) 15.64,39.5 U1.8
  Bottom Layer w0.203: v1(15.64,39.51) 16.36,38.78 24.45,38.78 25.36,37.87 25.36,34.02 31.22,28.15 36.84,28.15 37.35,27.64 37.35,25.9 v1(37.78,25.47)
RST: length 48.1
  Top Layer w0.305: C7.2 19.78,50.57 v1(19.78,51.14) S1.1
  Bottom Layer w0.203: H2.5 2.89,25.78 2.89,48.54 5.48,51.14 v1(19.78,51.14)
SWCLK: length 25.4
  Top Layer w0.203: U1.62 20.56,45 20.56,43.18 v1(20.56,43.18)
  Bottom Layer w0.203: v1(20.56,43.18) 19.95,42.57 16.42,42.57 15.08,41.22 15.08,36.53 12.64,34.09 6.62,34.09 4.41,31.88
SWDIO: length 23.6
  Top Layer w0.203: U1.63 v1(20.05,43.64)
  Bottom Layer w0.203: H2.1 12.54,34.42 14.77,36.65 14.77,41.35 16.3,42.88 19.29,42.88 v1(20.05,43.64)
UART_RX: length 18.3
  Top Layer w0.203: v1(21.1,40.84) 20.08,39.83 20.08,33.53 U1.18 ; R20.2 v1(14.44,44.35)
  Bottom Layer w0.203: v1(14.44,44.35) 20.11,44.35 20.77,43.69 20.77,43.69 21.07,43.39 21.07,43.38 21.1,43.36 v1(21.1,40.84)
UART_TX: length 21.2
  Top Layer w0.203: v1(21.6,41.4) 21.6,40.54 20.55,39.49 U1.19 ; R26.2 v1(12.44,44.35)
  Bottom Layer w0.203: v1(21.6,41.4) 21.6,43.29 19.96,44.93 13.02,44.93 v1(12.44,44.35)
VREFH: length 10.2
  Top Layer w0.305: v1(25.83,27.38) R2.2 25.83,25.52 C5.2 C6.2 ; v1(26.19,29.58) 26.19,31.69 25.55,32.33 U1.29
  Bottom Layer w0.305: v1(25.83,27.38) 26.19,27.74 v1(26.19,29.58)
VREFL: length 10.2
  Top Layer w0.305: U1.26 24.05,32.33 23.41,31.69 v1(23.41,29.58) ; C6.1 C5.1 23.82,25.5 R8.2 v1(23.82,27.38)
  Bottom Layer w0.305: v1(23.82,27.38) 23.41,27.79 v1(23.41,29.58)
VSA1: length 3.8
  Top Layer w0.254: 34.55,47.1 Q7.8 ; 35.2,47.1 Q7.7 ; 35.85,47.1 Q7.6
  vias: v1(34.55,46.46) v1(34.78,55.9) v1(34.78,55.14) v1(34.78,54.38) v1(34.78,53.62) v1(34.78,52.85) v1(34.78,44.58) v1(35.2,46.46) v1(35.54,55.9) v1(35.54,55.14) v1(35.54,54.38) v1(35.54,53.62) v1(35.54,52.85) v1(35.54,45.34) v1(35.54,44.58) v1(35.54,43.81) v1(35.85,46.46) v1(36.3,55.9) v1(36.3,55.14) v1(36.3,54.38) v1(36.3,53.62) v1(36.3,52.85) v1(36.3,44.58)
VSA2: length 3.8
  Top Layer w0.254: Q4.3 Q10.6 ; Q4.2 Q10.7 ; Q4.1 Q10.8
  vias: v1(44.21,15.32) v1(44.67,13.44) v1(44.97,16.08) v1(44.97,15.32) v1(44.97,14.56) v1(45.14,7.15) v1(45.14,6.38) v1(45.14,5.62) v1(45.14,4.86) v1(45.14,4.1) v1(45.32,13.44) v1(45.74,15.32) v1(45.9,7.15) v1(45.9,6.38) v1(45.9,5.62) v1(45.9,4.86) v1(45.9,4.1) v1(45.97,13.44) v1(46.66,7.15) v1(46.66,6.38) v1(46.66,5.62) v1(46.66,4.86) v1(46.66,4.1)
VSB1: length 3.8
  Top Layer w0.254: 38.66,47.1 38.66,45.83 ; 39.31,47.1 39.31,45.83 ; 39.96,47.1 39.96,45.83
  vias: v1(38.66,46.46) v1(38.9,44.58) v1(39.31,46.46) v1(39.35,55.9) v1(39.35,55.14) v1(39.35,54.38) v1(39.35,53.62) v1(39.35,52.85) v1(39.66,45.34) v1(39.66,44.58) v1(39.66,43.82) v1(39.96,46.46) v1(40.11,55.9) v1(40.11,55.14) v1(40.11,54.38) v1(40.11,53.62) v1(40.11,52.85) v1(40.42,44.58) v1(40.88,55.9) v1(40.88,55.14) v1(40.88,54.38) v1(40.88,53.62) v1(40.88,52.85)
VSB2: length 3.8
  Top Layer w0.254: Q5.3 40.56,14.07 ; Q5.2 41.21,14.07 ; Q5.1 41.86,14.07
  vias: v1(40.1,15.42) v1(40.56,13.44) v1(40.57,7.15) v1(40.57,6.38) v1(40.57,5.62) v1(40.57,4.86) v1(40.57,4.1) v1(40.86,16.18) v1(40.86,15.42) v1(40.86,14.66) v1(41.21,13.44) v1(41.33,7.15) v1(41.33,6.38) v1(41.33,5.62) v1(41.33,4.86) v1(41.33,4.1) v1(41.62,15.42) v1(41.86,13.44) v1(42.09,7.15) v1(42.09,6.38) v1(42.09,5.62) v1(42.09,4.86) v1(42.09,4.1)
VSC1: length 3.8
  Top Layer w0.254: 42.77,47.1 Q9.8 ; 43.42,47.1 Q9.7 ; 44.07,47.1 Q9.6
  vias: v1(42.77,46.46) v1(43,44.58) v1(43.42,46.46) v1(43.76,45.34) v1(43.76,44.58) v1(43.76,43.81) v1(43.92,55.9) v1(43.92,55.14) v1(43.92,54.38) v1(43.92,53.62) v1(43.92,52.85) v1(44.07,46.46) v1(44.52,44.58) v1(44.69,55.9) v1(44.69,55.14) v1(44.69,54.38) v1(44.69,53.62) v1(44.69,52.85) v1(45.45,55.9) v1(45.45,55.14) v1(45.45,54.38) v1(45.45,53.62) v1(45.45,52.85)
VSC2: length 3.8
  Top Layer w0.254: Q6.3 Q12.6 ; Q6.2 Q12.7 ; Q6.1 Q12.8
  vias: v1(35.99,15.42) v1(35.99,7.15) v1(35.99,6.38) v1(35.99,5.62) v1(35.99,4.86) v1(35.99,4.1) v1(36.45,13.44) v1(36.76,16.18) v1(36.76,15.42) v1(36.76,14.66) v1(36.76,7.15) v1(36.76,6.38) v1(36.76,5.62) v1(36.76,4.86) v1(36.76,4.1) v1(37.1,13.44) v1(37.52,15.42) v1(37.52,7.15) v1(37.52,6.38) v1(37.52,5.62) v1(37.52,4.86) v1(37.52,4.1) v1(37.75,13.44)
$1N501: length 5.8
  Top Layer w0.508: U4.5 22.05,16.88 C26.2 22.05,15.19 C27.2 23.77,15.19 D1.1
$1N557: length 2.4
  Top Layer w0.508: U4.6 23.94,16.88 C21.1 ; 25.21,16.88 L1.1
$1N566: length 2.3
  Top Layer w0.508: C21.2 25.21,18.82 24.86,19.17 23.94,19.17
$1N644: length 7.2
  Top Layer w0.508: 22.04,19.17 22.04,20.64 R23.2 R22.1 24.43,20.66 26.35,18.73 C22.1
$1N1214: length 7.2
  Top Layer w0.508: C32.1 17.97,18.73 16.05,20.66 R38.1 R45.2 13.65,20.64 13.65,19.17
$1N1220: length 2.3
  Top Layer w0.508: C31.2 16.83,18.82 16.48,19.17 15.55,19.17
$1N1247: length 5.8
  Top Layer w0.508: U7.5 13.66,16.88 C37.2 13.67,15.19 C38.2 15.39,15.19 D13.1
$1N1253: length 2.4
  Top Layer w0.508: 16.83,16.88 L2.1 ; C31.1 15.56,16.88 U7.6
$1N1472: length 6.9
  Top Layer w0.305: P1.1 13.29,47.94 14.44,46.79 R20.1
$1N1476: length 3.1
  Top Layer w0.305: P1.2 12.43,45.44 R26.1
$1N6025: length 10.8
  Top Layer w0.305: D8.2 42.63,35.23 42.3,34.9 U2.4 ; D8.2 D10.1 ; D8.2 D6.2 D4.2 43.39,30.22 R3.2 45,29.95 C36.1
$1N6283: length 5.6
  Top Layer w0.203: C30.1 34.49,36.88 37.37,36.88 37.7,36.56 U2.12
$1N6285: length 4.8
  Top Layer w0.203: U2.15 37.85,34.93 34.52,34.93 C28.2
$1N6287: length 5
  Top Layer w0.203: U2.18 37.52,33.4 37.04,32.92 34.49,32.92 C18.2
$1N6291: length 13.6
  Top Layer w0.203: D8.1 45.73,35.94 v1(45.73,35.94) ; U2.14 37.03,35.4 v1(36.53,35.89) C30.2
  Bottom Layer w0.203: v1(45.73,35.94) 44.56,35.94 43.72,36.79 38.8,36.79 37.42,35.41 37.02,35.41 v1(36.53,35.89)
$1N6297: length 14.9
  Top Layer w0.203: C28.1 35.5,33.89 35.52,33.87 v1(36.53,33.87) 37.85,33.87 U2.17 ; D6.1 45.73,34.34 v1(45.73,34.34)
  Bottom Layer w0.203: v1(45.73,34.34) 43.59,36.48 38.93,36.48 37.6,35.16 37.6,34.19 37.28,33.87 v1(36.53,33.87)
$1N6302: length 18.8
  Top Layer w0.203: C18.1 36.03,31.4 37.3,31.4 v1(37.92,32.02) 38.79,32.02 39.03,32.26 U2.20 ; v1(45.73,32.69) 45.73,32.69 D4.1
  Bottom Layer w0.203: v1(45.73,32.69) 44.89,33.53 44.89,34.75 43.47,36.18 39.05,36.18 37.91,35.03 37.91,32.03 v1(37.92,32.02)
$1N6836: length 9.3
  Top Layer w0.203: R6.2 37.55,39.75 37.55,46.04 36.5,47.1
$1N7137: length 9.3
  Top Layer w0.203: 40.61,47.1 41.66,46.04 41.66,39.75 R7.2
$1N7325: length 9.3
  Top Layer w0.203: R11.2 45.77,39.75 45.77,46.04 44.72,47.1
$1N7915: length 10.8
  Top Layer w0.305: 37.13,24.66 38.09,24.66 38.42,25 U5.4 ; 37.13,24.66 37.13,29.66 R5.2 C39.1 ; 37.13,24.66 37.13,23.04
$1N7926: length 12.9
  Top Layer w0.203: D9.1 v1(35.6,24.66) ; 42.64,24.5 43.48,24.5 v1(43.98,24) C35.2
  Bottom Layer w0.203: v1(35.6,24.66) 36.84,23.42 41.97,23.42 42.94,24.38 43.6,24.38 v1(43.98,24)
$1N7930: length 5.6
  Top Layer w0.203: C35.1 46.02,23.01 44.01,23.01 43.68,23.34 U5.12
$1N7941: length 19.1
  Top Layer w0.203: C25.1 44.48,28.5 42.1,28.5 v1(41.48,27.88) U5.20 ; D5.1 34.78,27.91 v1(34.78,27.18)
  Bottom Layer w0.203: v1(41.48,27.88) 42.1,27.26 42.1,26.01 42.43,25.68 42.43,24.74 41.72,24.03 37.15,24.03 36.41,24.76 36.41,26.29 35.85,26.85 35.11,26.85 v1(34.78,27.18)
$1N7948: length 4.8
  Top Layer w0.203: U5.15 42.67,24.97 46,24.97 C29.2
$1N7950: length 14.9
  Top Layer w0.203: U5.17 42.66,26.02 v1(43.99,26.02) 45,26.02 45.01,26.01 C29.1 ; D7.1 v1(35.6,26.29)
  Bottom Layer w0.203: v1(43.99,26.02) 43.1,26.02 42.73,25.65 42.73,24.61 41.85,23.72 37.02,23.72 36.1,24.64 36.1,25.78 v1(35.6,26.29)
$1N7956: length 5
  Top Layer w0.203: 42.64,26.5 43,26.5 43.47,26.97 46.03,26.97 C25.2
$1N8558: length 9.3
  Top Layer w0.203: Q5.4 38.86,13.86 38.86,20.15 R14.2
$1N8585: length 9.3
  Top Layer w0.203: Q6.4 34.75,13.86 34.75,20.15 R15.2
$1N8605: length 9.3
  Top Layer w0.203: R13.2 42.97,20.15 42.97,13.86 Q4.4
$3N600: length 3.7
  Top Layer w0.305: S2.3 9.3,52.14 R9.2
$3N887: length 1.9
  Top Layer w0.305: LED1.2 13.46,26.37 R12.2
$3N939: length 1.9
  Top Layer w0.305: R17.2 15.65,26.37 LED2.2
$3N1087: length 5.6
  Top Layer w0.762: R69.1 17.59,30.12 C49.2
$3N2329: length 15.7
  Top Layer w0.305: R4.1 17.77,47.7 18.71,46.76 v1(21.83,46.76) ; U1.54 v1(24.55,43.61)
  Bottom Layer w0.305: v1(24.55,43.61) 24.55,45.92 23.71,46.76 v1(21.83,46.76)
$1N11687: length 1.8
  Top Layer w0.203: 44.03,17.43 R21.2
$1N11719: length 1.8
  Top Layer w0.203: 44.71,42.47 R19.2
$1N11741: length 1.8
  Top Layer w0.203: 40.6,42.47 R18.2
$1N11762: length 1.8
  Top Layer w0.203: 36.49,42.47 R16.2
$1N11822: length 1.8
  Top Layer w0.203: 39.92,17.43 R24.2
$1N11840: length 1.8
  Top Layer w0.203: 35.81,17.43 R25.2

## Copper pours and planes (outline as drawn; the poured copper is in the pictures)
GND on Top Layer: -22.18,81.05 83.68,81.05 83.68,-51.99 -22.18,-51.99
GND on Bottom Layer: -13.02,82.12 108.73,82.12 108.73,-20.22 -13.02,-20.22
GND on Inner1: -30.41,86.51 92.06,86.51 92.06,-32.05 -30.41,-32.05
GND on 内层2: -59.7,101.32 109.79,101.32 109.79,-37.16 -59.7,-37.16
VBAT on Top Layer: 50.78,47.82 33.74,47.82 33.74,51.31 50.78,51.31
VBAT on Top Layer: 35,12.08 51.98,12.08 51.98,8.61 35,8.61
VBAT on Top Layer: 53.25,47.89 57.31,47.89 57.31,17.24 47.53,17.24 47.53,19.4 51.88,19.4 53.25,20.77
VBAT on Bottom Layer: 57.32,17.24 57.31,17.24 53.25,17.24 51.99,15.98 51.99,10.57 50.03,8.61 34.95,8.61 34.95,12.08 46.38,12.08 47.54,13.23 47.54,17.24 47.53,17.24 47.53,17.39 49.54,19.4 51.88,19.4 53.25,20.77 53.25,48.26 52.59,48.93 50.11,48.93 49,47.82 33.74,47.82 33.74,51.34 55.2,51.34 57.32,49.22
VBAT on Inner1: 48.48,-0.18 60.11,-0.18 60.14,-0.15 60.14,60.15 47.21,60.15 47.21,14.17 48.48,12.9
VSA1 on Top Layer: 33.73,43.25 33.73,46.87 34.31,47.45 36.12,47.45 36.12,46.87 37.31,45.67 37.31,43.25
VSA1 on Inner1: 33.49,56.95 37.61,56.95 37.61,43.93 36.93,43.25 33.49,43.25
VSA2 on Top Layer: 46.79,16.65 46.79,13.03 46.21,12.45 44.4,12.45 44.4,13.03 43.21,14.22 43.21,16.65
VSA2 on Inner1: 43.82,2.95 47.96,2.95 47.96,12.68 46.73,13.91 46.73,16.64 43.17,16.64 43.17,11.68 43.82,11.03
VSB1 on Top Layer: 37.84,43.25 37.84,46.87 38.42,47.46 40.23,47.46 40.23,46.87 41.42,45.68 41.42,43.25
VSB1 on Inner1: 42.18,56.95 42.18,49 41.44,48.26 41.44,43.26 38.04,43.26 38.04,56.95
VSB2 on Top Layer: 42.68,16.64 42.68,13.03 42.09,12.44 40.29,12.44 40.29,13.03 39.1,14.22 39.1,16.64
VSB2 on Inner1: 43.39,2.95 43.39,10.9 42.66,11.64 42.66,16.64 39.25,16.64 39.25,2.95
VSC1 on Top Layer: 41.95,43.25 41.95,46.87 42.53,47.45 44.34,47.45 44.34,46.87 45.53,45.67 45.53,43.25
VSC1 on Inner1: 42.61,56.95 46.75,56.95 46.75,47.22 45.52,45.99 45.52,43.26 41.96,43.26 41.96,48.21 42.61,48.87
VSC2 on Top Layer: 38.57,16.65 38.57,13.03 37.99,12.45 36.18,12.45 36.18,13.03 34.99,14.22 34.99,16.65
VSC2 on Inner1: 34.71,2.95 38.82,2.95 38.82,15.97 38.14,16.65 34.71,16.65

Small or netless copper shapes (teardrops, artwork), in the pictures only: 319 on Top Layer, 61 on Bottom Layer, 10 on Inner1
